# Altium schematic sheet EDU_High-Speed-Design_MCU.SchDoc: MCU
size 431 x 279 mm; Date: not used; ApprovedBy: not used; CheckedBy: not used; Author: not used; DrawnBy: not used; Organization: not used; Address4: not used; SheetNumber: 4; SheetTotal: 4; Time: not used; ImagePath: not used; Application_BuildNumber: not used
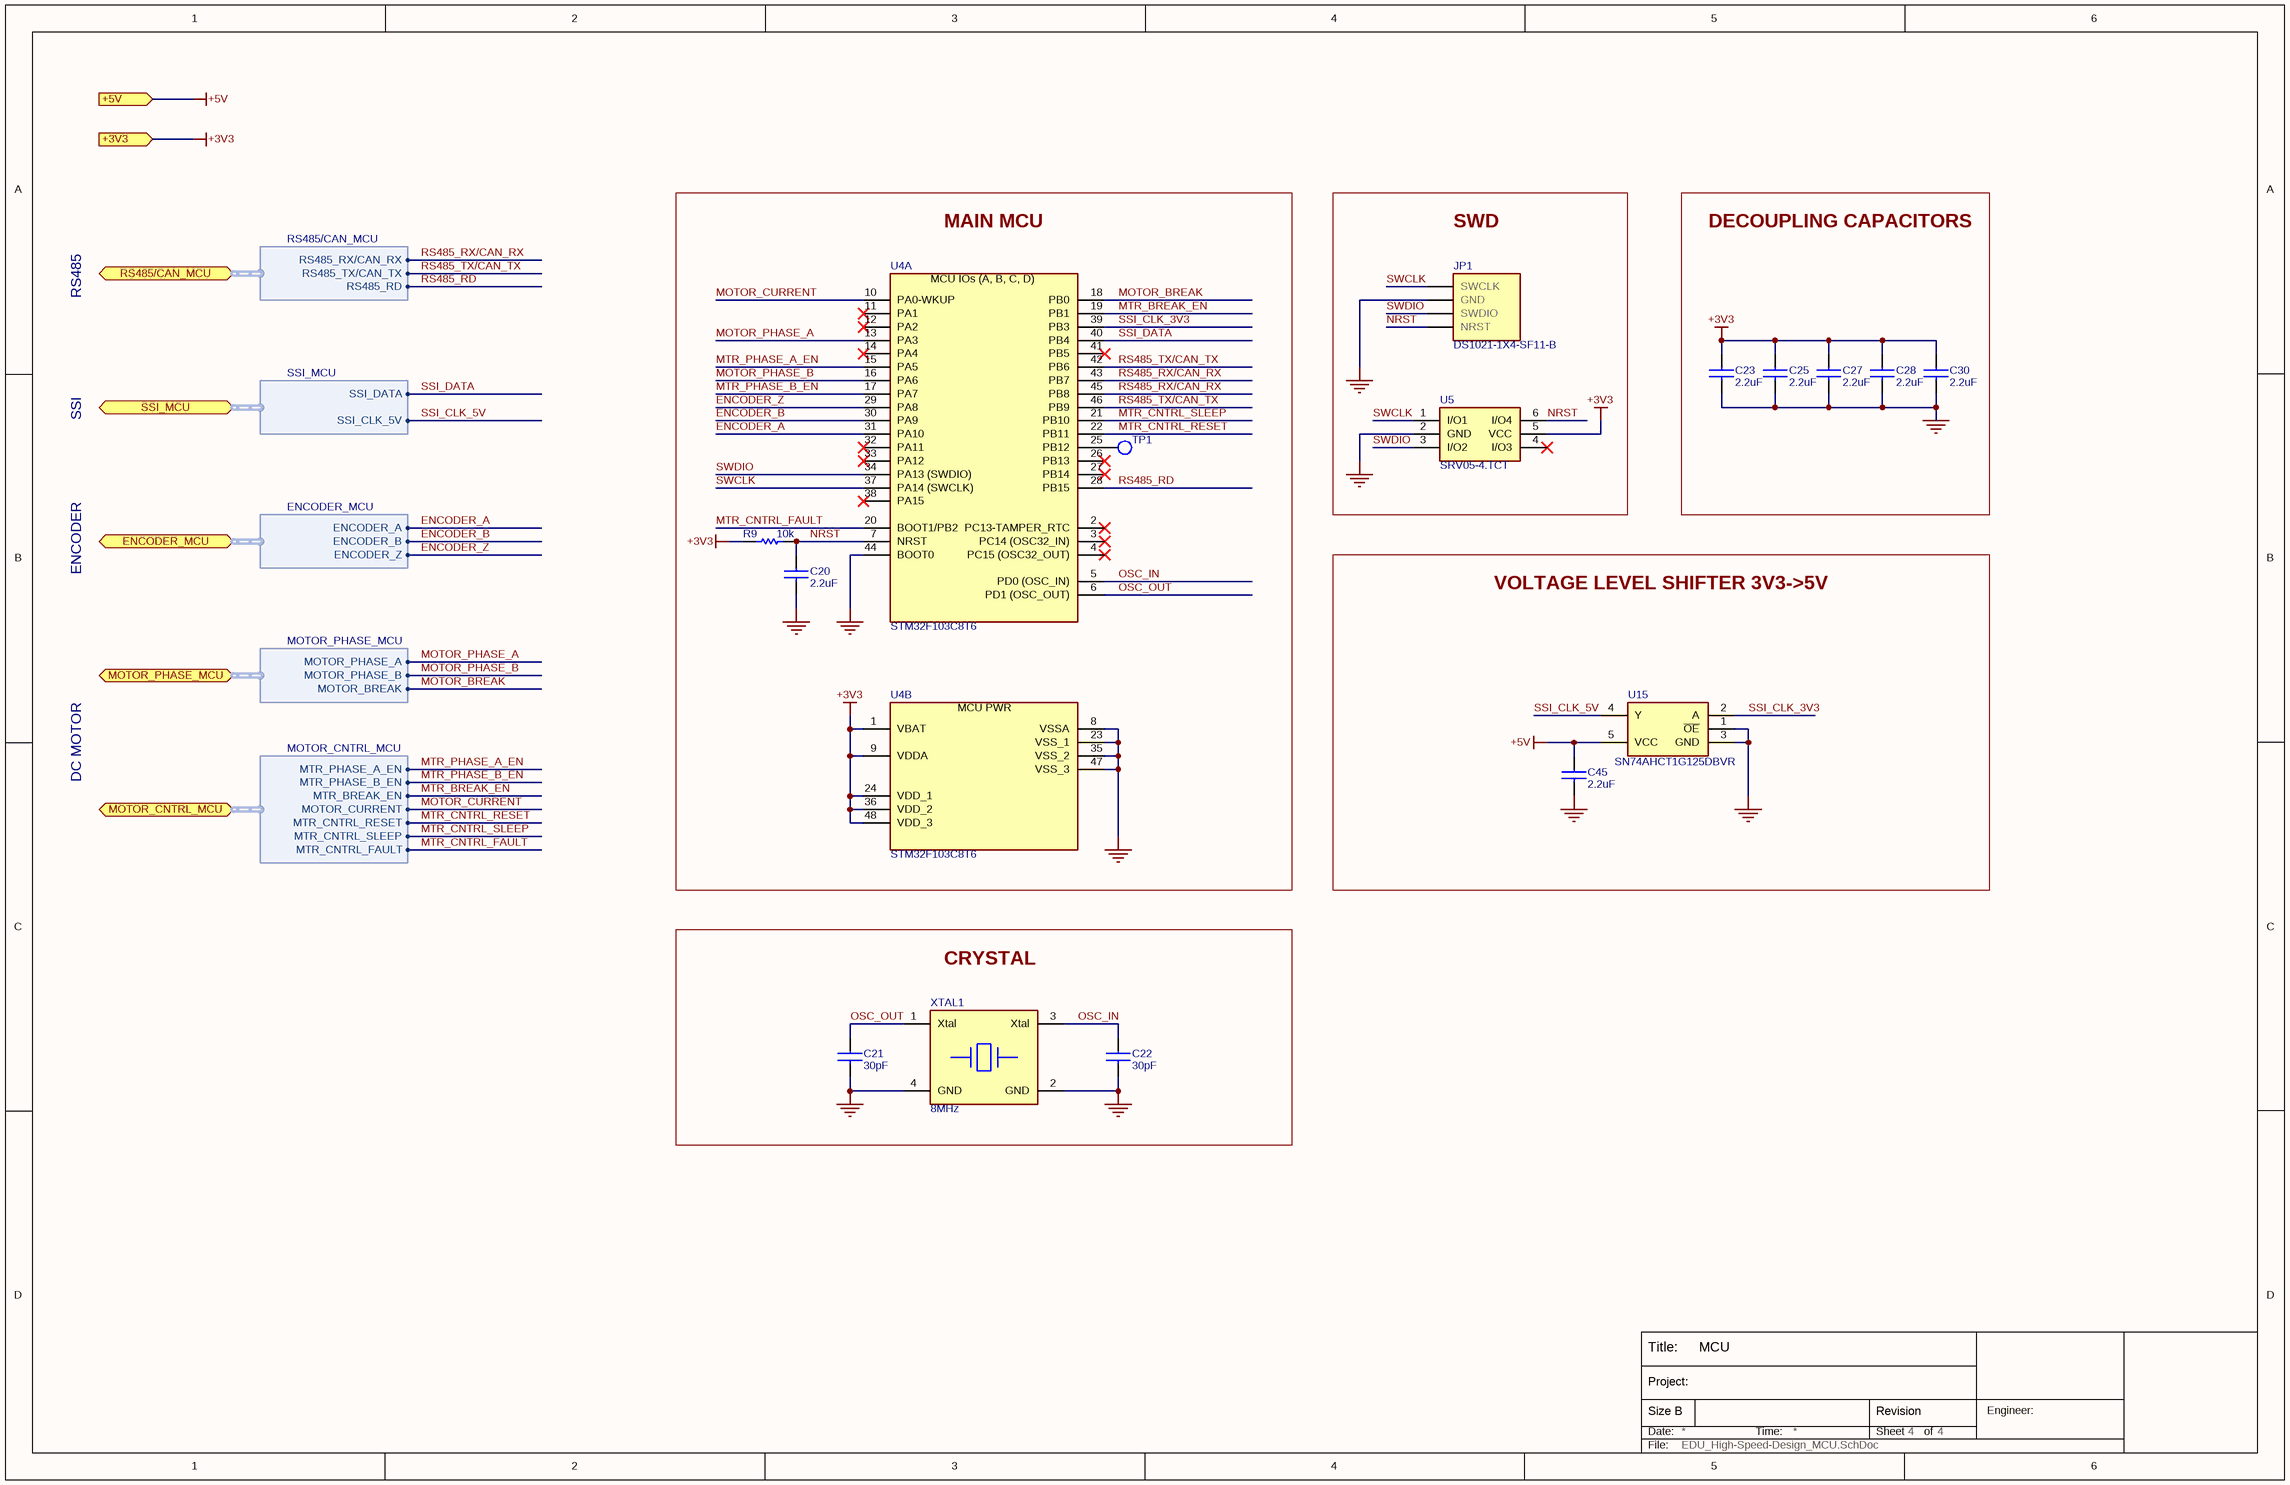
[diagram p0: EDU_High-Speed-Design_MCU.SchDoc]

## Parts
C20  2.2uF  [CAP_0603]
C21  30pF  [CAP_0603]
C22  30pF  [CAP_0603]
C23  2.2uF  [CAP_0603]
C25  2.2uF  [CAP_0603]
C27  2.2uF  [CAP_0603]
C28  2.2uF  [CAP_0603]
C30  2.2uF  [CAP_0603]
C45  2.2uF  [CAP_0603]
JP1  DS1021-1X4-SF11-B  [DS1021-1X4-SF11-B]
R9  10k  [RES_0603]
TP1  TEST_POINT_SMT  [TEST_POINT_SMT]  (value not drawn)  (no BOM)
U4  STM32F103C8T6  [LQFP48]  (parts A,B of 2)
U5  SRV05-4.TCT  [SOT-23-6]
U15  SN74AHCT1G125DBVR  [SOT-23-5]
XTAL1  8MHz  [ABM3B-8.000MHZ-B2-T]

## Blocks framed on the sheet
MAIN MCU: C20 R9 TP1 U4
SWD: JP1 U5
DECOUPLING CAPACITORS: C23 C25 C27 C28 C30
VOLTAGE LEVEL SHIFTER 3V3->5V: C45 U15
CRYSTAL: C21 C22 XTAL1

## Ports
+3V3 (in), +5V (in), ENCODER_MCU (bidir, harness ENCODER_MCU), MOTOR_CNTRL_MCU (bidir, harness MOTOR_CNTRL_MCU), MOTOR_PHASE_MCU (bidir, harness MOTOR_PHASE_MCU), RS485/CAN_MCU (bidir, harness RS485/CAN_MCU), SSI_MCU (bidir, harness SSI_MCU)

## Harnesses
SSI_MCU: SSI_DATA, SSI_CLK_5V
RS485/CAN_MCU: RS485_RX/CAN_RX, RS485_TX/CAN_TX, RS485_RD
MOTOR_PHASE_MCU: MOTOR_PHASE_A, MOTOR_PHASE_B, MOTOR_BREAK
ENCODER_MCU: ENCODER_A, ENCODER_B, ENCODER_Z
MOTOR_CNTRL_MCU: MTR_PHASE_A_EN, MTR_PHASE_B_EN, MTR_BREAK_EN, MTR_CNTRL_RESET, MTR_CNTRL_SLEEP, MTR_CNTRL_FAULT, MOTOR_CURRENT

## Nets
+3V3: C23.1 C25.1 C27.1 C28.1 C30.1 R9.2 U4.1(VBAT) U4.9(VDDA) U4.24(VDD_1) U4.36(VDD_2) U4.48(VDD_3) U5.5(VCC) ; port +3V3
+5V: C45.1 U15.5(VCC) ; port +5V
GND: C20.2 C21.2 C22.2 C23.2 C25.2 C27.2 C28.2 C30.2 C45.2 JP1.2 U4.8(VSSA) U4.23(VSS_1) U4.35(VSS_2) U4.44(BOOT0) U4.47(VSS_3) U5.2(GND) U15.1(~{OE}) U15.3(GND) XTAL1.2(GND) XTAL1.4(GND)
ENCODER_A: U4.31(PA10) ; port ENCODER_MCU.ENCODER_A
ENCODER_B: U4.30(PA9) ; port ENCODER_MCU.ENCODER_B
ENCODER_Z: U4.29(PA8) ; port ENCODER_MCU.ENCODER_Z
MOTOR_BREAK: U4.18(PB0) ; port MOTOR_PHASE_MCU.MOTOR_BREAK
MOTOR_CURRENT: U4.10(PA0-WKUP) ; port MOTOR_CNTRL_MCU.MOTOR_CURRENT
MOTOR_PHASE_A: U4.13(PA3) ; port MOTOR_PHASE_MCU.MOTOR_PHASE_A
MOTOR_PHASE_B: U4.16(PA6) ; port MOTOR_PHASE_MCU.MOTOR_PHASE_B
MTR_BREAK_EN: U4.19(PB1) ; port MOTOR_CNTRL_MCU.MTR_BREAK_EN
MTR_CNTRL_FAULT: U4.20(BOOT1/PB2) ; port MOTOR_CNTRL_MCU.MTR_CNTRL_FAULT
MTR_CNTRL_RESET: U4.22(PB11) ; port MOTOR_CNTRL_MCU.MTR_CNTRL_RESET
MTR_CNTRL_SLEEP: U4.21(PB10) ; port MOTOR_CNTRL_MCU.MTR_CNTRL_SLEEP
MTR_PHASE_A_EN: U4.15(PA5) ; port MOTOR_CNTRL_MCU.MTR_PHASE_A_EN
MTR_PHASE_B_EN: U4.17(PA7) ; port MOTOR_CNTRL_MCU.MTR_PHASE_B_EN
NRST: C20.1 JP1.4 R9.1 U4.7(NRST) U5.6(I/O4)
OSC_IN: C22.1 U4.5(PD0_(OSC_IN)) XTAL1.3(Xtal)
OSC_OUT: C21.1 U4.6(PD1_(OSC_OUT)) XTAL1.1(Xtal)
RS485_RD: U4.28(PB15) ; port RS485/CAN_MCU.RS485_RD
RS485_RX/CAN_RX: U4.43(PB7) U4.45(PB8) ; port RS485/CAN_MCU.RS485_RX/CAN_RX
RS485_TX/CAN_TX: U4.42(PB6) U4.46(PB9) ; port RS485/CAN_MCU.RS485_TX/CAN_TX
SSI_CLK_3V3: U4.39(PB3) U15.2(A)
SSI_CLK_5V: U15.4(Y) ; port SSI_MCU.SSI_CLK_5V
SSI_DATA: U4.40(PB4) ; port SSI_MCU.SSI_DATA
SWCLK: JP1.1 U4.37(PA14_(SWCLK)) U5.1(I/O1)
SWDIO: JP1.3 U4.34(PA13_(SWDIO)) U5.3(I/O2)
NetTP1_1: TP1.1 U4.25(PB12)

Not connected (* = marked no-connect by the designer): U4 2(PC13-TAMPER_RTC)* 3(PC14_(OSC32_IN))* 4(PC15_(OSC32_OUT))* 11(PA1)* 12(PA2)* 14(PA4)* 26(PB13)* 27(PB14)* 32(PA11)* 33(PA12)* 38(PA15)* 41(PB5)*; U5 4(I/O3)*

## Notes on the sheet
- RS485
- SSI
- ENCODER
- DC MOTOR
- Title:
- Date:
- Size B
- Project:
- Time:
- Sheet
- Revision
- of
- Engineer:
- File:
- (in symbol STM32F103C8T6, part A) MCU IOs (A, B, C, D)
- (in symbol STM32F103C8T6, part B) MCU PWR

## Library data of the parts
C20 C23 C25 C27 C28 C30 C45 = CC0603KRX5R8BB225: CAP CER 2.2UF 25V X5R 0603; Manufacturer 1: Yageo; Supplier 1: Elitan; Manufacturer Part Number 1: CC0603KRX5R8BB225; Capacitance: 2.2uF; TKE: X5R; Voltage: 25V; Supplier Part Number 1: CC0603KRX5R8BB225@YAGEO; Supplier 1 Unit Price, rub: 3,74
C21 C22 = CC0603JRNPO9BN300: CAP CER 30PF 50V C0G/NPO 0603; Manufacturer 1: Yageo; TKE: C0G; Supplier 1: Elitan; Manufacturer Part Number 1: CC0603JRNPO9BN300; Capacitance: 30pF; Voltage: 50V; Supplier Part Number 1: CC0603JRNPO9BN300@YAGEO; Supplier 1 Unit Price, rub: 1,44
JP1 = DS1021-1X4-SF11-B: CONN HEADER VERT 4POS 2.54MM; Manufacturer 1: Connfly electronic (Zhenqin); Contact_1: SWCLK; Contact_2: GND; Contact_3: SWDIO; Contact_4: NRST; Manufacturer Part Number 1: DS1021-1X4-SF11-B; Supplier Part Number 1: DS1021-1X4-SF11-B@CONNFLY; Supplier 1: Elitan; Supplier 1 Unit Price, rub: 15
R9 = RC0603FR-0710KL: RES 10K OHM 1% 1/10W 0603; Manufacturer 1: Yageo; Supplier 1: Elitan; Manufacturer Part Number 1: RC0603FR-0710KL; Supplier Part Number 1: RC0603FR-0710KL@YAGEO; Supplier 1 Unit Price, rub: 1,18; Resistance: 10k
TP1 = TEST_POINT_SMT: STM TEST POINT
U4 = STM32F103C8T6: IC MCU 32BIT 64KB FLASH 48LQFP; Manufacturer 1: STMicroelectronics; Supplier 1: Elitan; Manufacturer Part Number 1: STM32F103C8T6; Supplier Part Number 1: STM32F103C8T6@ST; Supplier 1 Unit Price, rub: 153
U5 = SRV05-4.TCT: TVS DIODE 5VWM 17.5VC SOT23-6; Manufacturer 1: Semtech; Supplier 1: Elitan; Manufacturer Part Number 1: SRV05-4.TCT; Supplier Part Number 1: SRV05-4.TCT@SEMTECH; Supplier 1 Unit Price, rub: 73
U15 = SN74AHCT1G125DBVR: IC BUF NON-INVERT 5.5V SOT23-5; Manufacturer 1: Texas Instruments; Supplier 1: Elitan; Manufacturer Part Number 1: SN74AHCT1G125DBVR; Supplier Part Number 1: SN74AHCT1G125DBV@TI; Supplier 1 Unit Price, rub: 22,10
XTAL1 = ABM3B-8.000MHZ-B2-T: CRYSTAL 8.0000MHZ 18PF SMD; Manufacturer 1: Abracon; Supplier 1: Elitan; Manufacturer Part Number 1: ABM3B-8.000MHZ-B2-T; Supplier Part Number 1: ABM3B-8.000MHZ-B2-T@ABRACON; Supplier 1 Unit Price, rub: 95; Frequency: 8MHz